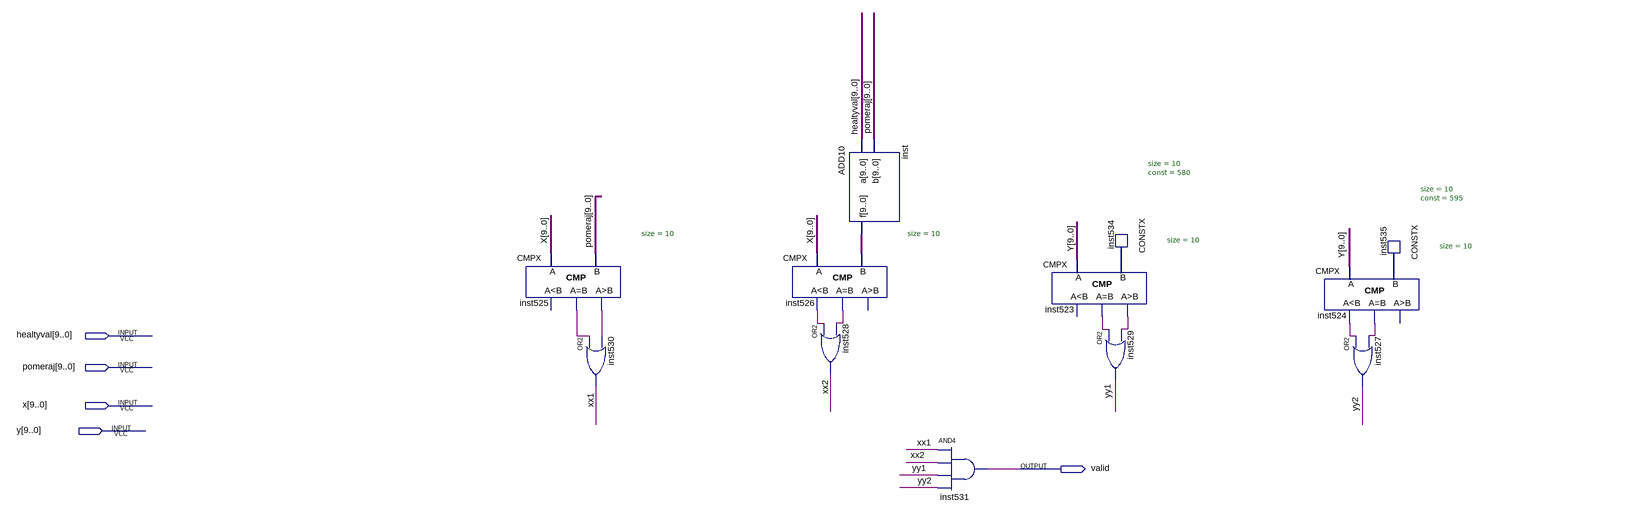
[diagram p0: schematic sheet]
// Quartus schematic HealtyPrikaz.bdf as structural Verilog: 12 symbols, 5 pins
module HealtyPrikaz (
  input  [9:0] healtyval,
  input  [9:0] pomeraj,
  input  [9:0] x,
  input  [9:0] y,
  output valid
);

  wire inst523_eq, inst523_gr, inst524_eq, inst524_ls, inst525_eq, inst525_gr, inst526_eq, inst526_ls, xx1,
       xx2, yy1, yy2;
  wire [9:0] inst534_data, inst535_data, inst_f;

  CMPX #(.size(10)) inst525 (.A(x), .B(pomeraj), .eq(inst525_eq), .gr(inst525_gr));  // open: ls
  or inst530 (xx1, inst525_eq, inst525_gr);
  CMPX #(.size(10)) inst526 (.A(x), .B(inst_f), .ls(inst526_ls), .eq(inst526_eq));  // open: gr
  or inst528 (xx2, inst526_ls, inst526_eq);
  ADD10 inst (.a(healtyval), .b(pomeraj), .f(inst_f));
  and inst531 (valid, xx1, xx2, yy1, yy2);
  CMPX #(.size(10)) inst523 (.A(y), .B(inst534_data), .eq(inst523_eq), .gr(inst523_gr));  // open: ls
  CONSTX #(.size(10), .\const (580)) inst534 (.data(inst534_data));
  or inst529 (yy1, inst523_eq, inst523_gr);
  CMPX #(.size(10)) inst524 (.A(y), .B(inst535_data), .ls(inst524_ls), .eq(inst524_eq));  // open: gr
  or inst527 (yy2, inst524_ls, inst524_eq);
  CONSTX #(.size(10), .\const (595)) inst535 (.data(inst535_data));
endmodule
